# EAGLE design IceBoard-Rev2 (EAGLE 7.5.0)
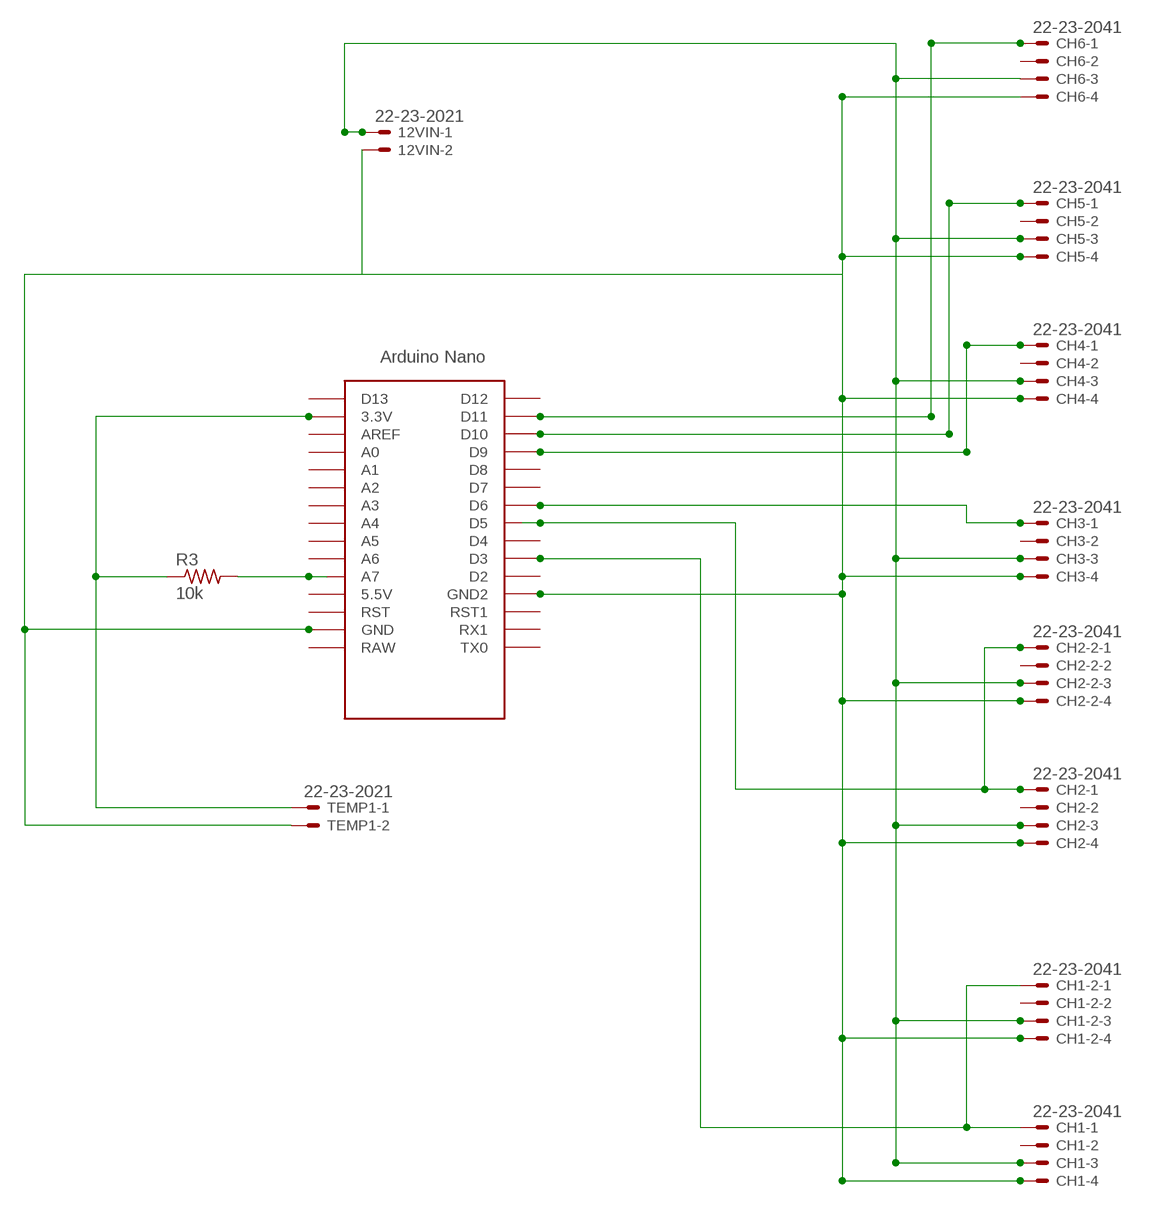
[diagram p0: schematic, sheet 1]

## Parts
12VIN  22-23-2021  [22-23-2021]
CH1  22-23-2041  [22-23-2041]
CH1-2  22-23-2041  [22-23-2041]
CH2  22-23-2041  [22-23-2041]
CH2-2  22-23-2041  [22-23-2041]
CH3  22-23-2041  [22-23-2041]
CH4  22-23-2041  [22-23-2041]
CH5  22-23-2041  [22-23-2041]
CH6  22-23-2041  [22-23-2041]
R3  10k  R-US_R0805  [R0805]
TEMP1  22-23-2021  [22-23-2021]
U$1  NANO  [NANO]

## Nets
10K: R3.1 TEMP1.1 U$1.3.3V
GND: 12VIN.2 CH1-2.4 CH1.4 CH2-2.4 CH2.4 CH3.4 CH4.4 CH5.4 CH6.4 TEMP1.2 U$1.GND U$1.GND1(GND2)
N$1: CH5.1 U$1.D10
N$2: CH6.1 U$1.D11
N$3: CH1-2.1 CH1.1 U$1.D3
N$4: CH2-2.1 CH2.1 U$1.D5
N$5: CH3.1 U$1.D6
N$6: CH4.1 U$1.D9
N$8: 12VIN.1 CH1-2.3 CH1.3 CH2-2.3 CH2.3 CH3.3 CH4.3 CH5.3 CH6.3
N$11: R3.2 U$1.A7
Unconnected: CH1-2.2 CH1.2 CH2-2.2 CH2.2 CH3.2 CH4.2 CH5.2 CH6.2 U$1.5V(5.5V) U$1.A0 U$1.A1 U$1.A2 U$1.A3 U$1.A4 U$1.A5 U$1.A6 U$1.AREF U$1.D2 U$1.D4 U$1.D7 U$1.D8 U$1.D12 U$1.D13 U$1.ICSP1 U$1.ICSP2 U$1.ICSP3 U$1.ICSP4 U$1.ICSP5 U$1.ICSP6 U$1.RAW U$1.RST U$1.RST1 U$1.RX1 U$1.TX0

## Library data of the parts
12VIN TEMP1 = con-molex:22-23-2021: .100" (2.54mm) Center Header - 2 Pin; MF: MOLEX; MPN: 22-23-2021; OC_FARNELL: 1462926; OC_NEWARK: 25C3832
CH1 CH1-2 CH2 CH2-2 CH3-CH6 = con-molex:22-23-2041: .100" (2.54mm) Center Header - 4 Pin; MF: MOLEX; MPN: 22-23-2041; OC_FARNELL: 1462920; OC_NEWARK: 38C0355
R3 = resistor:R-US_: RESISTOR, American symbol
U$1 = Arduino-clone:NANO: Arduino Nano

## Board
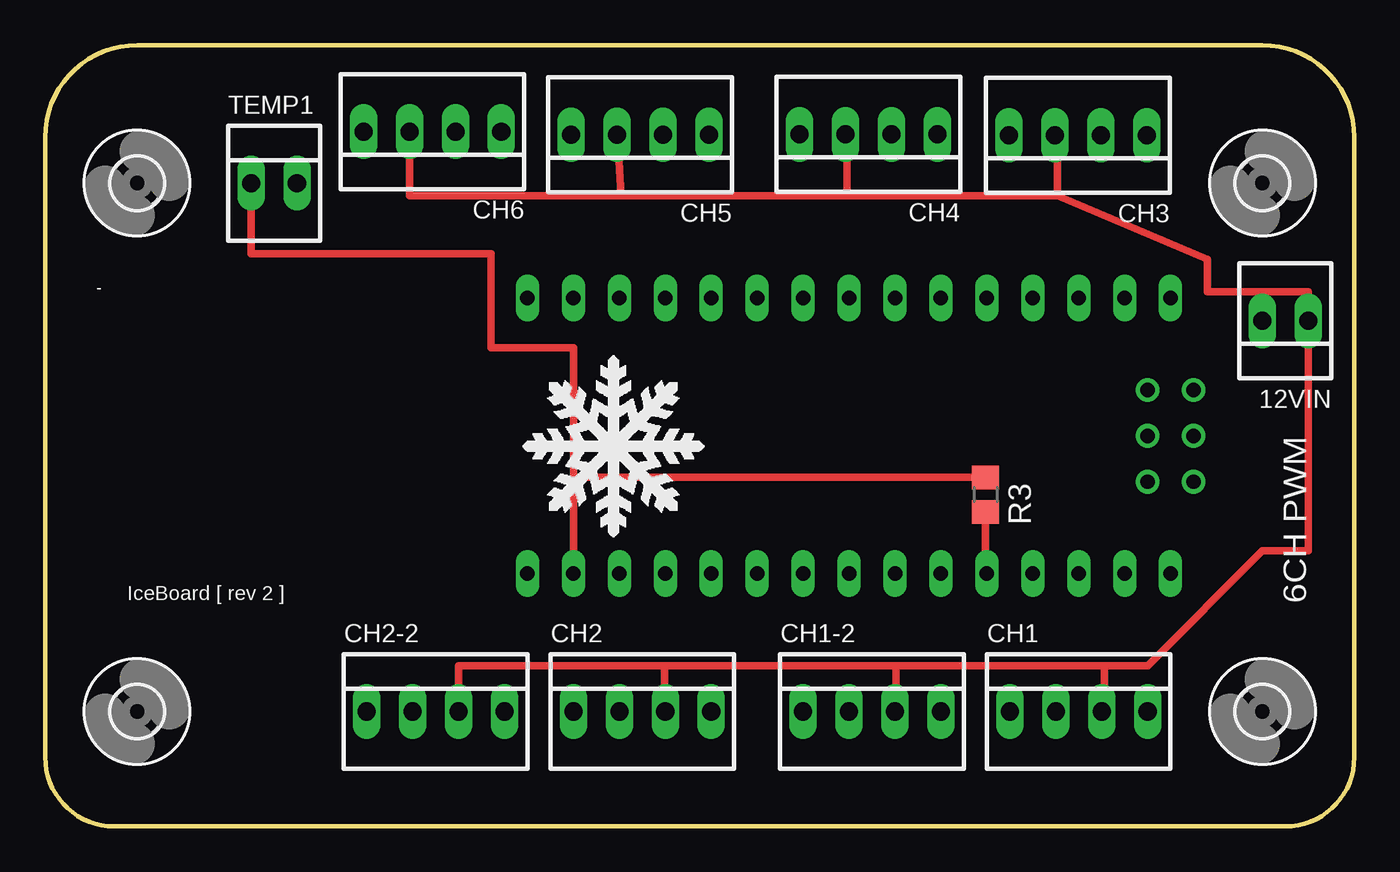
[diagram p1: board, top side]
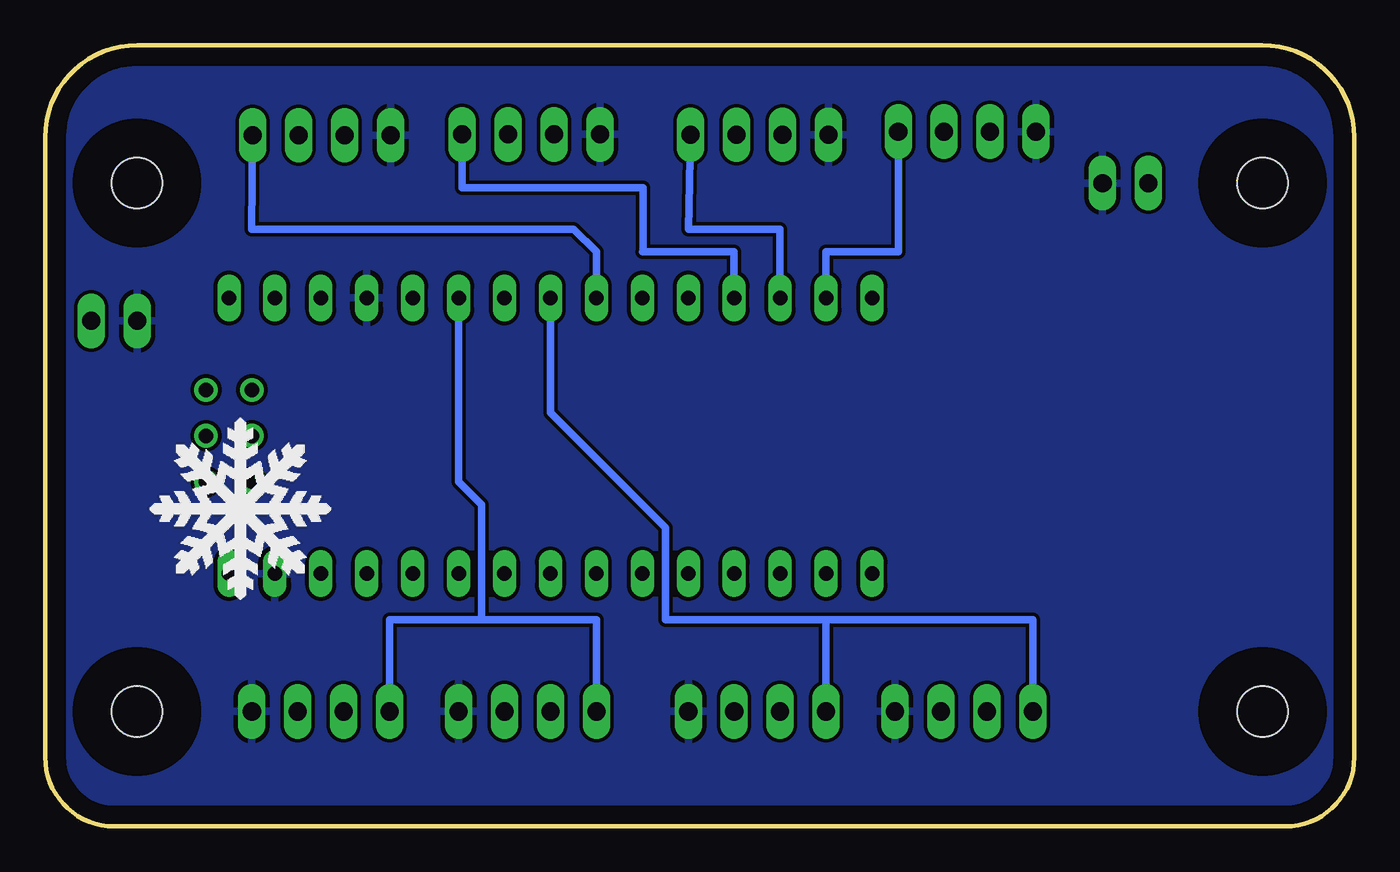
[diagram p2: board, bottom side, seen from below]

Size 72.39 x 43.18 mm. Coordinates in mm from the lower left corner, seen from the top.
Outline: 0,38.1 0,3.81 arc90 3.81,0 68.58,0 arc90 72.39,3.81 72.39,38.1 arc90 67.31,43.18 5.08,43.18 arc90 0,38.1
Copper layers (1*16): Top 0.035mm / dielectric 1.5mm / Bottom 0.035mm
Design rules "default": minimum track width 10mil, minimum drill 24mil, track to track 8mil, track to pad 8mil, pad to pad 8mil, via to via 8mil, smd to smd 8mil, copper to edge 40mil, drill to drill 8mil, minimum pad ring 10mil, minimum via ring 8mil, stop-mask expansion 4mil, vias tented up to drill 0mil, thermal gap 10mil

### Footprints (pad centres in the part's own frame; a part is rotated, then mirrored left to right if it is on the bottom)
22-23-2021 = drill 1 long: 1 -1.27,0; 2 1.27,0
22-23-2041 = drill 1 long: 1 -3.81,0; 2 -1.27,0; 3 1.27,0; 4 3.81,0
R0805 = smd 1.3 x 1.5: 1 -0.95,0; 2 0.95,0
NANO = drill 0.8 long: 3.3V -10.16,24.13; 5V -10.16,-1.27; A0 -10.16,19.05; A1 -10.16,16.51; A2 -10.16,13.97; A3 -10.16,11.43; A4 -10.16,8.89; A5 -10.16,6.35; A6 -10.16,3.81; A7 -10.16,1.27; AREF -10.16,21.59; D2 5.08,1.27; D3 5.08,3.81; D4 5.08,6.35; D5 5.08,8.89; D6 5.08,11.43; D7 5.08,13.97; D8 5.08,16.51; D9 5.08,19.05; D10 5.08,21.59; D11 5.08,24.13; D12 5.08,26.67; D13 -10.16,26.67; GND -10.16,-6.35; GND1 5.08,-1.27; RAW -10.16,-8.89; RST -10.16,-3.81; RST1 5.08,-3.81; RX1 5.08,-6.35; TX0 5.08,-8.89 | drill 0.8: ICSP1 -5.08,-10.16; ICSP2 -5.08,-7.62; ICSP3 -2.54,-10.16; ICSP4 -2.54,-7.62; ICSP5 0,-10.16; ICSP6 0,-7.62
2,8 = hole 2.8: 0,0

### Placement (x,y rotation side)
12VIN  68.58,27.94 180 top
CH1  57.15,6.35 0 top
CH1-2  45.72,6.35 0 top
CH2  33.02,6.35 0 top
CH2-2  21.59,6.35 0 top
CH3  57.1,38.2 180 top
CH4  45.52,38.25 180 top
CH5  32.89,38.23 180 top
CH6  21.41,38.4 180 top
R3  51.99,18.34 270 top
TEMP1  12.65,35.56 0 top
U$1  53.34,24.13 90 top
U$2  [2,8]  5.08,35.56 0 top
U$3  [2,8]  5.08,6.35 0 top
U$4  [2,8]  67.31,6.35 0 top
U$5  [2,8]  67.31,35.56 0 top

### Tracks (layer width: path | path; a pad name or v marks a point on that pad's centre or on a via)
10K
  Top 0.406: 29.21,19.29 29.21,26.47 24.66,26.47 24.66,31.65 11.38,31.65 TEMP1.1 | 29.21,19.29 U$1.3.3V | R3.1 29.21,19.29
GND
  Top 0.254: 59.64,13.92 U$1.GND
  pour Bottom: 0.05,38.02 arc-90 5.16,43.13 67.21,43.13 arc-90 72.42,37.92 72.42,3.91 arc-90 68.45,-0.05 3.71,-0.05 arc-90 0,3.66 0.05,32.41
N$1
  Bottom 0.406: CH5.1 36.83,33.02 31.75,33.02 U$1.D10
N$2
  Bottom 0.406: U$1.D11 29.21,31.75 25.2,31.75 CH6.1
N$3
  Bottom 0.406: CH1-2.1 41.91,11.43 48.26,11.43 | CH1.1 53.34,11.43 48.26,11.43 | U$1.D3 49.53,19.05 48.26,17.78 48.26,11.43
N$4
  Bottom 0.406: U$1.D5 44.45,22.86 38.1,16.51 38.1,11.43 29.21,11.43 | 29.21,11.43 17.78,11.43 CH2-2.1 | CH2.1 29.21,11.43
N$5
  Bottom 0.406: U$1.D6 41.91,31.75 43.18,33.02 60.96,33.02 CH3.1
N$6
  Bottom 0.406: U$1.D9 34.29,31.75 39.32,31.75 | 49.53,38.1 CH4.1 49.33,35.31 39.32,35.31 39.32,31.75 | 39.37,31.75 39.32,31.75
N$8
  Top 0.406: 58.57,8.89 60.96,8.89 67.31,15.24 69.85,15.24 12VIN.1 69.85,29.57 64.26,29.57 64.26,31.34 55.98,34.85 | 58.57,8.89 47.04,8.89 | 47.04,8.89 34.24,8.89 | 34.24,8.89 22.86,8.89 CH2-2.3 | CH2.3 34.24,6.35 34.24,8.89 | CH1.3 58.57,6.35 58.57,8.89 | CH1-2.3 47.04,6.35 47.04,8.89 | 55.98,34.85 44.35,34.85 | 44.35,34.85 31.85,34.85 | 31.85,34.85 20.14,34.85 CH6.3 | CH4.3 44.35,38.25 44.35,34.85 | CH3.3 55.98,38.2 55.98,34.85 | CH5.3 31.65,38.23 31.85,34.85
N$11
  Top 0.406: R3.2 51.99,14.05 U$1.A7

### Text on the board
tPlace: IceBoard [ rev 2 ] | 6CH PWM
bPlace: /Users/tink3rbot/Desktop/snowflake.bmp
bStop: [tink3r]